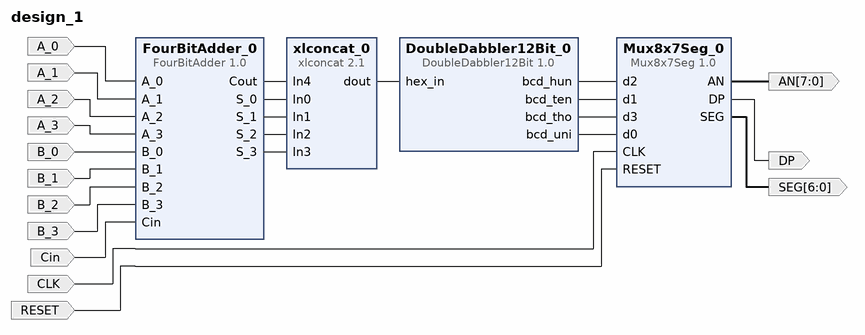
[diagram p0: block diagram of the top level]
# Vivado block design design_1, xc7a100tcsg324-1, Vivado 2022.2
create_bd_design design_1

create_bd_port -dir I -type clk CLK
create_bd_port -dir I -type rst RESET
create_bd_port -dir I A_0
create_bd_port -dir I A_1
create_bd_port -dir I A_2
create_bd_port -dir I A_3
create_bd_port -dir I B_0
create_bd_port -dir I B_1
create_bd_port -dir I B_2
create_bd_port -dir I B_3
create_bd_port -dir I Cin
create_bd_port -dir O -from 6 -to 0 SEG
create_bd_port -dir O -from 7 -to 0 AN
create_bd_port -dir O DP

create_bd_cell -type ip -vlnv xilinx.com:user:FourBitAdder:1.0 FourBitAdder_0
create_bd_cell -type ip -vlnv xilinx.com:user:Mux8x7Seg:1.0 Mux8x7Seg_0
create_bd_cell -type ip -vlnv xilinx.com:user:DoubleDabbler12Bit:1.0 DoubleDabbler12Bit_0
create_bd_cell -type ip -vlnv xilinx.com:ip:xlconcat:2.1 xlconcat_0
set_property -dict {CONFIG.NUM_PORTS 5} [get_bd_cells xlconcat_0]

# ---- connections ----

connect_bd_net -net A_0_0_1 [get_bd_ports A_0] [get_bd_pins FourBitAdder_0/A_0]
connect_bd_net -net A_1_0_1 [get_bd_ports A_1] [get_bd_pins FourBitAdder_0/A_1]
connect_bd_net -net A_2_0_1 [get_bd_ports A_2] [get_bd_pins FourBitAdder_0/A_2]
connect_bd_net -net A_3_0_1 [get_bd_ports A_3] [get_bd_pins FourBitAdder_0/A_3]
connect_bd_net -net B_0_0_1 [get_bd_ports B_0] [get_bd_pins FourBitAdder_0/B_0]
connect_bd_net -net B_1_0_1 [get_bd_ports B_1] [get_bd_pins FourBitAdder_0/B_1]
connect_bd_net -net B_2_0_1 [get_bd_ports B_2] [get_bd_pins FourBitAdder_0/B_2]
connect_bd_net -net B_3_0_1 [get_bd_ports B_3] [get_bd_pins FourBitAdder_0/B_3]
connect_bd_net -net CLK_0_1 [get_bd_ports CLK] [get_bd_pins Mux8x7Seg_0/CLK]
connect_bd_net -net Cin_0_1 [get_bd_ports Cin] [get_bd_pins FourBitAdder_0/Cin]
connect_bd_net [get_bd_pins DoubleDabbler12Bit_0/bcd_hun] [get_bd_pins Mux8x7Seg_0/d2]
connect_bd_net [get_bd_pins DoubleDabbler12Bit_0/bcd_ten] [get_bd_pins Mux8x7Seg_0/d1]
connect_bd_net [get_bd_pins DoubleDabbler12Bit_0/bcd_tho] [get_bd_pins Mux8x7Seg_0/d3]
connect_bd_net [get_bd_pins DoubleDabbler12Bit_0/bcd_uni] [get_bd_pins Mux8x7Seg_0/d0]
connect_bd_net [get_bd_pins FourBitAdder_0/Cout] [get_bd_pins xlconcat_0/In4]
connect_bd_net [get_bd_pins FourBitAdder_0/S_0] [get_bd_pins xlconcat_0/In0]
connect_bd_net [get_bd_pins FourBitAdder_0/S_1] [get_bd_pins xlconcat_0/In1]
connect_bd_net [get_bd_pins FourBitAdder_0/S_2] [get_bd_pins xlconcat_0/In2]
connect_bd_net [get_bd_pins FourBitAdder_0/S_3] [get_bd_pins xlconcat_0/In3]
connect_bd_net [get_bd_pins Mux8x7Seg_0/AN] [get_bd_ports AN]
connect_bd_net [get_bd_pins Mux8x7Seg_0/DP] [get_bd_ports DP]
connect_bd_net [get_bd_pins Mux8x7Seg_0/SEG] [get_bd_ports SEG]
connect_bd_net -net RESET_0_1 [get_bd_ports RESET] [get_bd_pins Mux8x7Seg_0/RESET]
connect_bd_net [get_bd_pins xlconcat_0/dout] [get_bd_pins DoubleDabbler12Bit_0/hex_in]

validate_bd_design
save_bd_design
